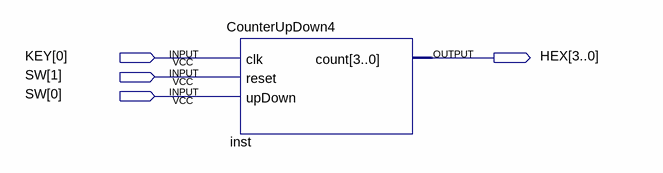
[diagram p0: schematic sheet]
// Quartus schematic Counter_Demo.bdf as structural Verilog: 1 symbols, 4 pins
module Counter_Demo (
  input  [0:0] KEY,
  input  [1:0] SW,
  output [3:0] HEX
);

  CounterUpDown4 inst (.clk(KEY[0]), .reset(SW[1]), .upDown(SW[0]), .count(HEX));
endmodule
